# EAGLE design ControllaBLE-Dual-SNES-v01 (EAGLE 6.6.0)
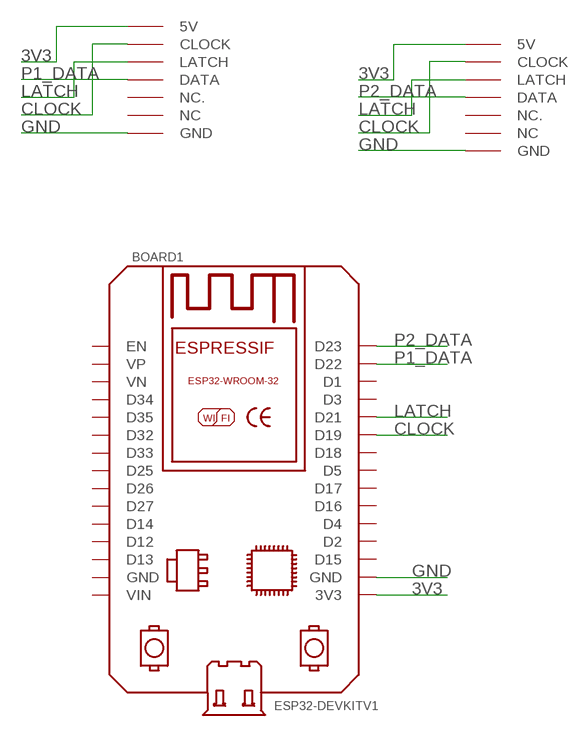
[diagram p0: schematic, sheet 1]

## Parts
BOARD1  ESP32DEVKITV1  [ESP32-DEVKITV1]
U$1  SNESCONN  [SNESCONN]
U$2  SNESCONN  [SNESCONN]

## Nets
3V3: BOARD1.3V3 U$1.5V U$2.5V
CLOCK: BOARD1.D19 U$1.CLOCK U$2.CLOCK
GND: BOARD1.GND@1(GND) U$1.GND U$2.GND
LATCH: BOARD1.D21 U$1.LATCH U$2.LATCH
P1_DATA: BOARD1.D22 U$1.DATA
P2_DATA: BOARD1.D23 U$2.DATA
Unconnected: BOARD1.D1 BOARD1.D2 BOARD1.D3 BOARD1.D4 BOARD1.D5 BOARD1.D12 BOARD1.D13 BOARD1.D14 BOARD1.D15 BOARD1.D16 BOARD1.D17 BOARD1.D18 BOARD1.D25 BOARD1.D26 BOARD1.D27 BOARD1.D32 BOARD1.D33 BOARD1.D34 BOARD1.D35 BOARD1.EN BOARD1.GND BOARD1.VIN BOARD1.VN BOARD1.VP U$1.NC U$1.NC. U$2.NC U$2.NC.

## Library data of the parts
BOARD1 = ESP32-DEVKITV1:ESP32DEVKITV1: https://github.com/shridattdudhat
U$1 U$2 = gamepad-conn:SNESCONN

## Board
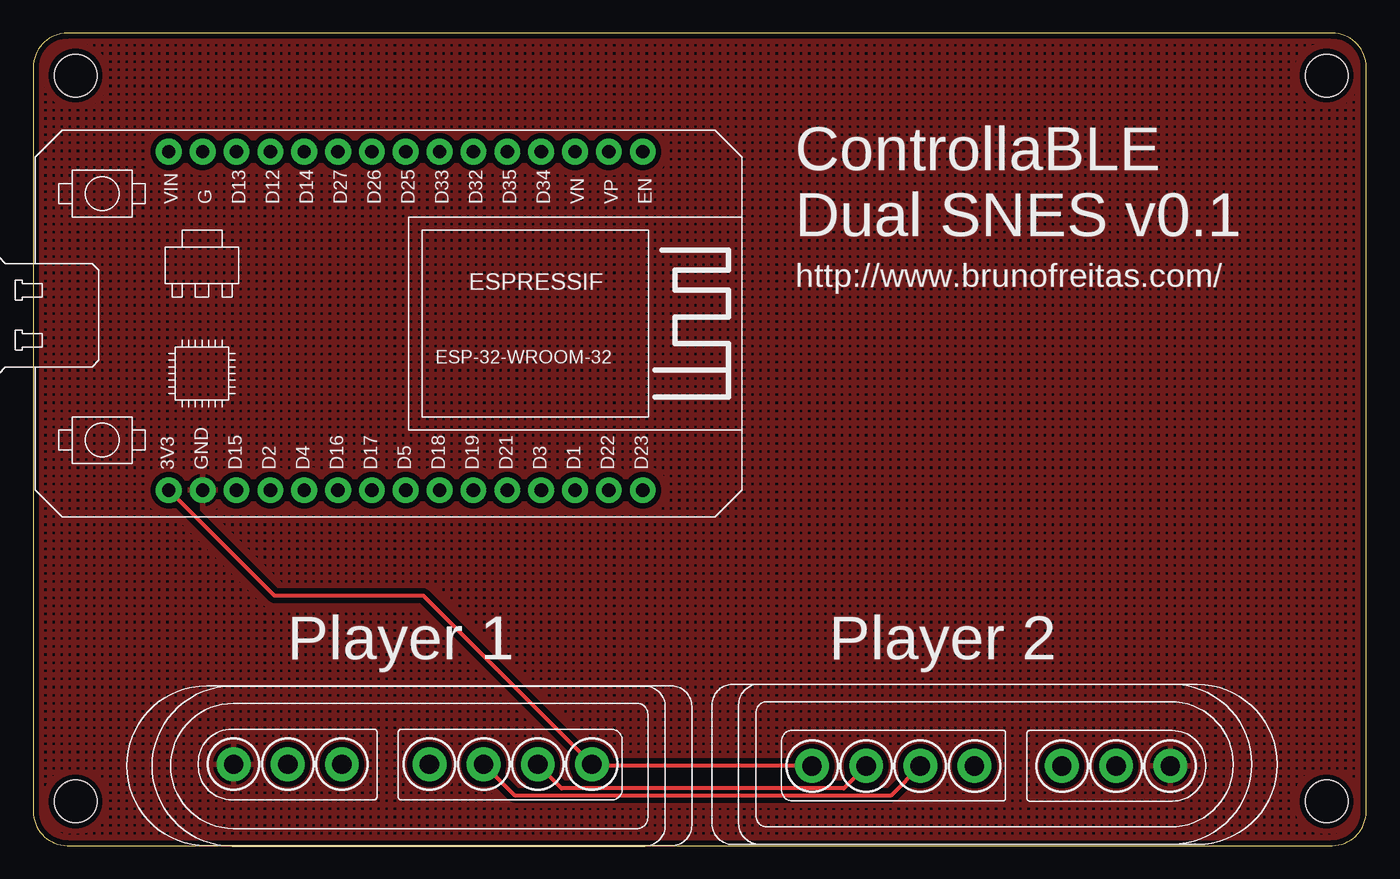
[diagram p1: board, top side]
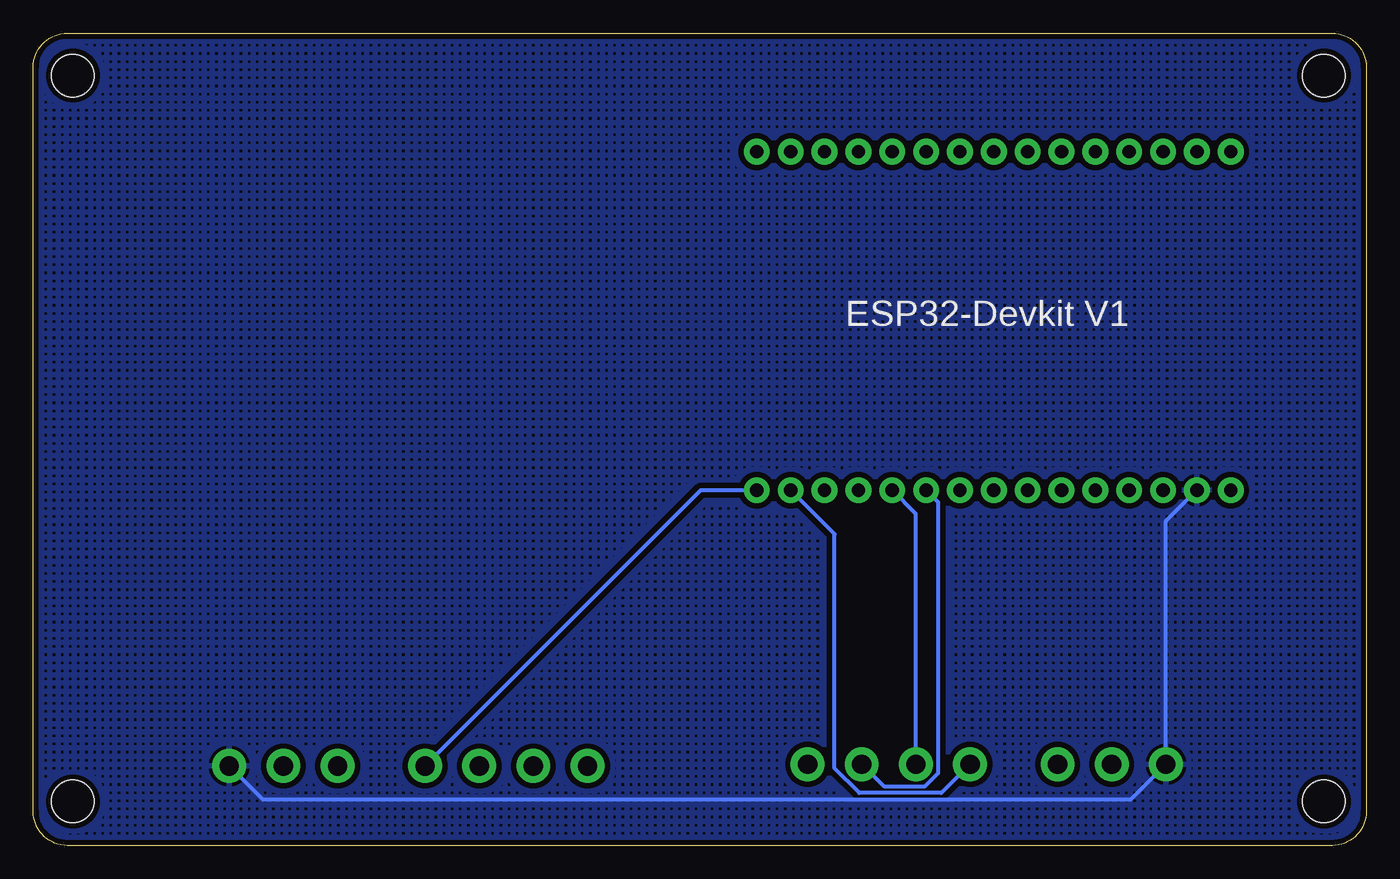
[diagram p2: board, bottom side, seen from below]

Size 100 x 60.95 mm. Coordinates in mm from the lower left corner, seen from the top.
Outline: 0,58.41 0,2.54 arc90 2.54,0 97.46,0 arc90 100,2.54 100,58.41 arc90 97.46,60.95 2.54,60.95 arc90 0,58.41
Copper layers (1*16): Top 0.035mm / dielectric 1.5mm / Bottom 0.035mm
Design rules "SeeedStudio_2layer_DRU_no_angle_20140221": minimum track width 6mil, minimum drill 12mil, track to track 6mil, track to pad 6mil, pad to pad 6mil, via to via 6mil, smd to smd 0mil, copper to edge 10mil, drill to drill 10mil, minimum pad ring 10mil, minimum via ring 6mil, stop-mask expansion 2mil, vias tented up to drill 100mil, thermal gap 10mil
Holes 3.2 mm at 3.17,57.78 3.17,3.3 97.03,57.78 97.03,3.3

### Footprints (pad centres in the part's own frame; a part is rotated, then mirrored left to right if it is on the bottom)
ESP32-DEVKITV1 = drill 1 pad 1.93: 3V3 0,0; D1 30.48,0; D2 7.62,0; D3 27.94,0; D4 10.16,0; D5 17.78,0; D12 7.62,25.4; D13 5.08,25.4; D14 10.16,25.4; D15 5.08,0; D16 12.7,0; D17 15.24,0; D18 20.32,0; D19 22.86,0; D21 25.4,0; D22 33.02,0; D23 35.56,0; D25 17.78,25.4; D26 15.24,25.4; D27 12.7,25.4; D32 22.86,25.4; D33 20.32,25.4; D34 27.94,25.4; D35 25.4,25.4; EN 35.56,25.4; GND 2.54,25.4; GND@1 2.54,0; VIN 0,25.4; VN 30.48,25.4; VP 33.02,25.4
SNESCONN = drill 1.448 pad 2.54: 5V 0,4.064; CLOCK 4.064,4.064; DATA 12.192,4.064; GND 26.884,4.064; LATCH 8.128,4.064; NC 18.756,4.064; NC. 22.82,4.064

### Placement (x,y rotation side)
BOARD1  10.16,26.67 0 top
U$1  41.91,10.16 180 top
U$2  58.42,1.91 0 top

### Tracks (layer width: path | path; a pad name or v marks a point on that pad's centre or on a via)
3V3
  Top 0.305: BOARD1.3V3 18.09,18.74 29.26,18.74 U$1.5V 42.04,5.97 U$2.5V
CLOCK
  Top 0.305: U$2.CLOCK 60.81,4.29 39.65,4.29 U$1.CLOCK
  Bottom 0.305: U$1.CLOCK 36.2,4.45 33.1,4.45 32.11,5.44 32.11,25.76 BOARD1.D19
GND
  Bottom 0.305: U$2.GND 82.77,3.43 17.69,3.43 U$1.GND 15.03,24.34 BOARD1.GND@1
  pour Bottom (isolate 0.406, hatched): 0,60.96 100.33,60.96 100.33,0 0,0
  pour Top (isolate 0.406, hatched): 0,60.96 100.33,60.96 100.33,0 0,0
LATCH
  Top 0.305: U$1.LATCH 36.09,3.79 64.36,3.79 U$2.LATCH
  Bottom 0.305: U$1.LATCH 33.78,24.89 BOARD1.D21
P1_DATA
  Bottom 0.305: U$1.DATA 31.87,3.94 38.03,3.94 39.88,5.79 39.88,23.37 BOARD1.D22
P2_DATA
  Bottom 0.305: U$2.DATA 49.91,26.67 BOARD1.D23

### Text on the board
tPlace: ControllaBLE / Dual SNES v0.1 | http://www.brunofreitas.com/ | Player 1 | Player 2